# Altium project MiniRobot.PrjPcb
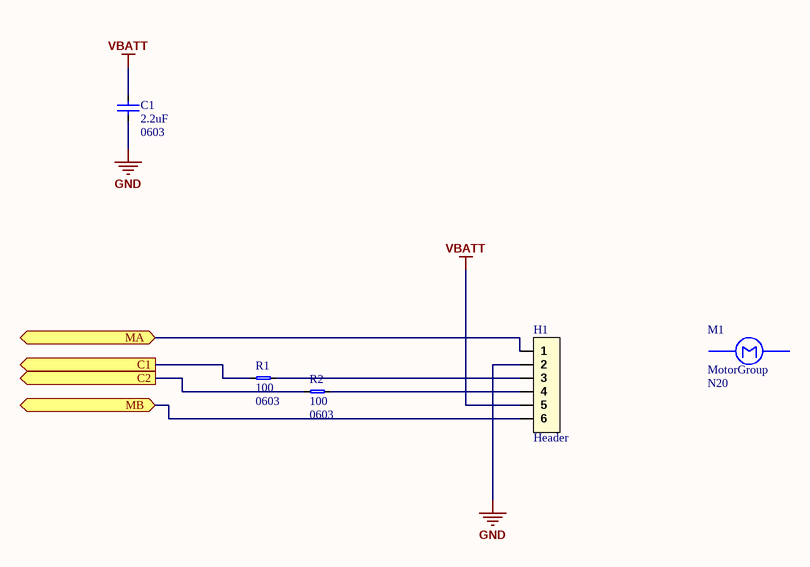
[diagram p0: MR_Motor.SchDoc]
6 sheets, 47 parts. Net scope: flat (ports and power ports of the same name join across sheets).
Board file: MiniRobot.PcbDoc
Sheets:
  MR_Motor.SchDoc
  MR_Motor_Control.SchDoc
  MR_Mcu.SchDoc
  MR_Power.SchDoc
  MR_RangeSensor.SchDoc
  MR_UartConnector.SchDoc

## Sheet MR_Motor.SchDoc
size A4; CompanyName: BeeIonic; SheetNumber: 2; SheetTotal: 7

### Parts
C1  value 2.2uF  Package: 0603  [0603_CAP_LD]  (hidden comment: CerCap)
H1  Header  [HEADER_1X6_PICOBLADE_653106124022]
M1  MotorGroup  Reference: N20  [MotorGroup]
R1  value 100  Package: 0603  [0603_RES_LD]  (hidden comment: Resistor)
R2  value 100  Package: 0603  [0603_RES_LD]  (hidden comment: Resistor)

### Ports
C1 (out), C2 (out), MA (bidir), MB (bidir)

### Nets
GND: C1.1 H1.2
VBATT: C1.2 H1.5
NetH1_1: H1.1 ; port MA
NetH1_3: H1.3 R1.2
NetH1_4: H1.4 R2.2
NetH1_6: H1.6 ; port MB
NetR1_1: R1.1 ; port C1
NetR2_1: R2.1 ; port C2

### Notes on the sheet
- Project :
- Title :
- Sheet:
- of
- Creation Date :
- Designer :
- Modified Date :

### Library data of the parts
C1 = CerCap: Ceramic Capacitor; Type: *; Voltage/Power: *
H1 = Header_6x1: Header 6x1 Pins
M1 = Motor
R1 R2 = Resistor: Precision: *

## Sheet MR_Motor_Control.SchDoc
size A4; CompanyName: BeeIonic; SheetNumber: 3; SheetTotal: 7
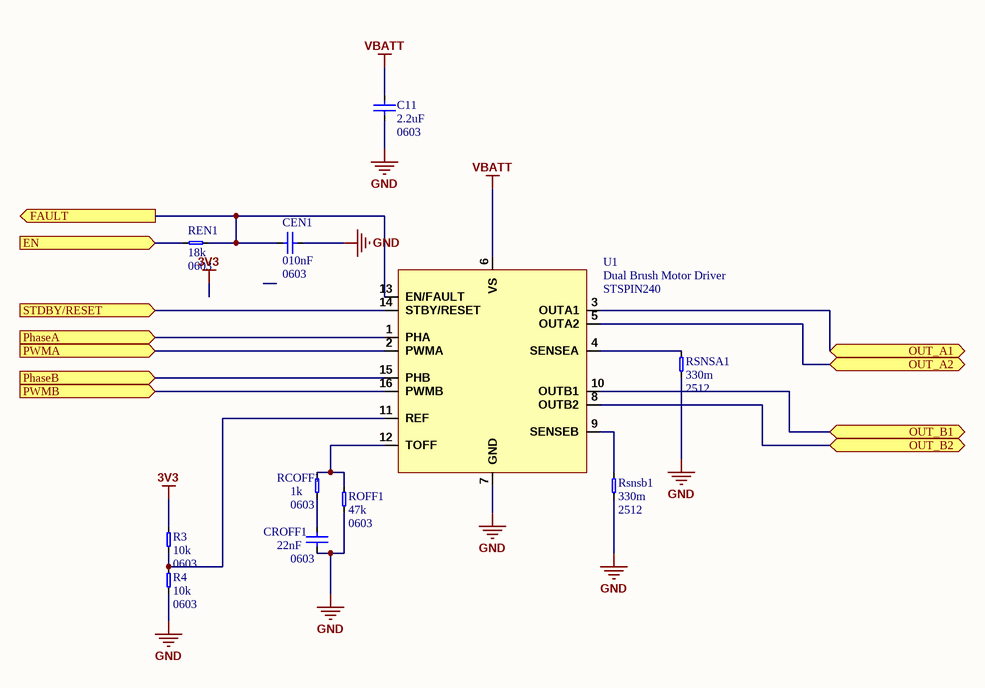
[diagram p1: MR_Motor_Control.SchDoc]

### Parts
C11  value 2.2uF  Package: 0603  [0603_CAP_LD]  (hidden comment: CerCap)
CEN1  value 010nF  Package: 0603  [0603_CAP_LD]  (hidden comment: CerCap)
CROFF1  value 22nF  Package: 0603  [0603_CAP_LD]  (hidden comment: CerCap)
R3  value 10k  Package: 0603  [0603_RES_LD]  (hidden comment: Resistor)
R4  value 10k  Package: 0603  [0603_RES_LD]  (hidden comment: Resistor)
RCOFF1  value 1k  Package: 0603  [0603_RES_LD]  (hidden comment: Resistor)
REN1  value 18k  Package: 0603  [0603_RES_LD]  (hidden comment: Resistor)
ROFF1  value 47k  Package: 0603  [0603_RES_LD]  (hidden comment: Resistor)
RSNSA1  value 330m  Package: 2512  [2512_RES_LD]  (hidden comment: Resistor)
Rsnsb1  value 330m  Package: 2512  [2512_RES_LD]  (hidden comment: Resistor)
U1  Dual Brush Motor Driver  [QFN-STSPIN240]

### Ports
EN (in), FAULT (out), OUT_A1 (bidir), OUT_A2 (bidir), OUT_B1 (bidir), OUT_B2 (bidir), PhaseA (in), PhaseB (in), PWMA (in), PWMB (in), STDBY/RESET (in)

### Nets
3V3: R3.2
GND: C11.1 CEN1.1 CROFF1.1 R4.1 ROFF1.1 RSNSA1.1 Rsnsb1.1 U1.7(GND)
VBATT: C11.2 U1.6(VS)
NetCEN1_2: CEN1.2 REN1.2 U1.13(EN/FAULT) ; port FAULT
NetCROFF1_2: CROFF1.2 RCOFF1.1
NetR3_1: R3.1 R4.2 U1.11(REF)
NetR11_1: U1.10(OUTB1) ; port OUT_B1
NetRCOFF1_2: RCOFF1.2 ROFF1.2 U1.12(TOFF)
NetREN1_1: REN1.1 ; port EN
NetRSNSA1_2: RSNSA1.2 U1.4(SENSEA)
NetRsnsb1_2: Rsnsb1.2 U1.9(SENSEB)
NetU1_1: U1.1(PHA) ; port PhaseA
NetU1_2: U1.2(PWMA) ; port PWMA
NetU1_3: U1.3(OUTA1) ; port OUT_A1
NetU1_5: U1.5(OUTA2) ; port OUT_A2
NetU1_8: U1.8(OUTB2) ; port OUT_B2
NetU1_14: U1.14(STBY/RESET) ; port STDBY/RESET
NetU1_15: U1.15(PHB) ; port PhaseB
NetU1_16: U1.16(PWMB) ; port PWMB

### Notes on the sheet
- Project :
- Title :
- Sheet:
- of
- Creation Date :
- Designer :
- Modified Date :

### Library data of the parts
C11 CEN1 CROFF1 = CerCap: Ceramic Capacitor; Type: *; Voltage/Power: *
U1 = STSPIN240: ST Dual Motor Driver; Reference: STSPIN240
R3 R4 RCOFF1 REN1 ROFF1 RSNSA1 Rsnsb1 = Resistor: Precision: *

## Sheet MR_Mcu.SchDoc
size A4; CompanyName: BeeIonic; SheetNumber: 4; SheetTotal: 7
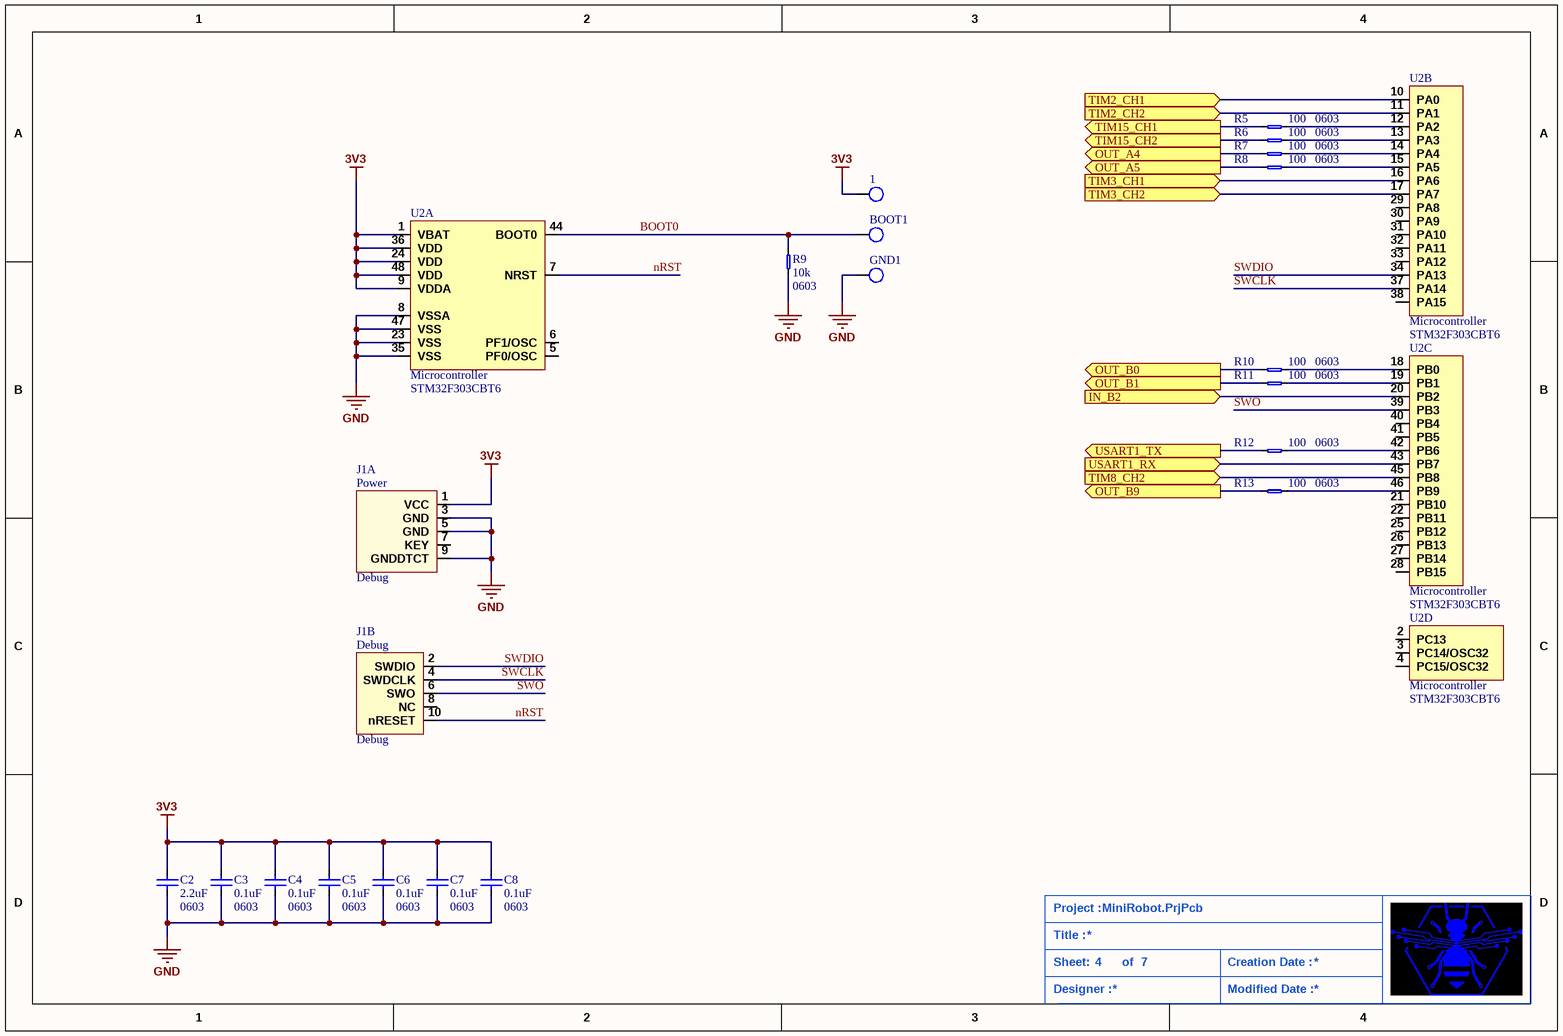
[diagram p2: MR_Mcu.SchDoc]

### Parts
1  TestPoint  [ROUND_TEST_POINT]  (value not drawn)  (no BOM)
BOOT1  TestPoint  [ROUND_TEST_POINT]  (value not drawn)  (no BOM)
C2  value 2.2uF  Package: 0603  [0603_CAP_LD]  (hidden comment: CerCap)
C3  value 0.1uF  Package: 0603  [0603_CAP_LD]  (hidden comment: CerCap)
C4  value 0.1uF  Package: 0603  [0603_CAP_LD]  (hidden comment: CerCap)
C5  value 0.1uF  Package: 0603  [0603_CAP_LD]  (hidden comment: CerCap)
C6  value 0.1uF  Package: 0603  [0603_CAP_LD]  (hidden comment: CerCap)
C7  value 0.1uF  Package: 0603  [0603_CAP_LD]  (hidden comment: CerCap)
C8  value 0.1uF  Package: 0603  [0603_CAP_LD]  (hidden comment: CerCap)
GND1  TestPoint  [ROUND_TEST_POINT]  (value not drawn)  (no BOM)
J1  Debug  [62201021121]  (parts A,B of 2)
R5  value 100  Package: 0603  [0603_RES_LD]  (hidden comment: Resistor)
R6  value 100  Package: 0603  [0603_RES_LD]  (hidden comment: Resistor)
R7  value 100  Package: 0603  [0603_RES_LD]  (hidden comment: Resistor)
R8  value 100  Package: 0603  [0603_RES_LD]  (hidden comment: Resistor)
R9  value 10k  Package: 0603  [0603_RES_LD]  (hidden comment: Resistor)
R10  value 100  Package: 0603  [0603_RES_LD]  (hidden comment: Resistor)
R11  value 100  Package: 0603  [0603_RES_LD]  (hidden comment: Resistor)
R12  value 100  Package: 0603  [0603_RES_LD]  (hidden comment: Resistor)
R13  value 100  Package: 0603  [0603_RES_LD]  (hidden comment: Resistor)
U2  Microcontroller  [STM32_LQFP48]  (parts A,B,C,D of 4)

### Ports
IN_B2 (in), OUT_A4 (out), OUT_A5 (out), OUT_B0 (out), OUT_B1 (out), OUT_B9 (out), TIM2_CH1 (in), TIM2_CH2 (in), TIM3_CH1 (in), TIM3_CH2 (in), TIM8_CH2 (in), TIM15_CH1 (out), TIM15_CH2 (out), USART1_RX (in), USART1_TX (out)

### Nets
3V3: 1.1(TP) C2.2 C3.2 C4.2 C5.2 C6.2 C7.2 C8.2 J1.1(VCC) U2.1(VBAT) U2.9(VDDA) U2.24(VDD) U2.36(VDD) U2.48(VDD)
GND: C2.1 C3.1 C4.1 C5.1 C6.1 C7.1 C8.1 GND1.1(TP) J1.3(GND) J1.5(GND) J1.9(GNDDTCT) R9.1 U2.8(VSSA) U2.23(VSS) U2.35(VSS) U2.47(VSS)
BOOT0: BOOT1.1(TP) R9.2 U2.44(BOOT0)
nRST: J1.10(nRESET) U2.7(NRST)
SWCLK: J1.4(SWDCLK) U2.37(PA14)
SWDIO: J1.2(SWDIO) U2.34(PA13)
SWO: J1.6(SWO) U2.39(PB3)
NetR5_1: R5.1 ; port TIM15_CH1
NetR5_2: R5.2 U2.12(PA2)
NetR6_1: R6.1 ; port TIM15_CH2
NetR6_2: R6.2 U2.13(PA3)
NetR7_1: R7.1 ; port OUT_A4
NetR7_2: R7.2 U2.14(PA4)
NetR8_1: R8.1 ; port OUT_A5
NetR8_2: R8.2 U2.15(PA5)
NetR10_1: R10.1 ; port OUT_B0
NetR10_2: R10.2 U2.18(PB0)
NetR11_1: R11.1 ; port OUT_B1
NetR11_2: R11.2 U2.19(PB1)
NetR12_1: R12.1 ; port USART1_TX
NetR12_2: R12.2 U2.42(PB6)
NetR13_1: R13.1 ; port OUT_B9
NetR13_2: R13.2 U2.46(PB9)
NetU2_10: U2.10(PA0) ; port TIM2_CH1
NetU2_11: U2.11(PA1) ; port TIM2_CH2
NetU2_16: U2.16(PA6) ; port TIM3_CH1
NetU2_17: U2.17(PA7) ; port TIM3_CH2
NetU2_20: U2.20(PB2) ; port IN_B2
NetU2_43: U2.43(PB7) ; port USART1_RX
NetU2_45: U2.45(PB8) ; port TIM8_CH2

Not connected (* = marked no-connect by the designer): J1 7(KEY) 8(NC); U2 2(PC13) 3(PC14/OSC32) 4(PC15/OSC32) 5(PF0/OSC) 6(PF1/OSC) 21(PB10) 22(PB11) 25(PB12) 26(PB13) 27(PB14) 28(PB15) 29(PA8) 30(PA9) 31(PA10) 32(PA11) 33(PA12) 38(PA15) 40(PB4) 41(PB5)

### Notes on the sheet
- Project :
- Title :
- Sheet:
- of
- Creation Date :
- Designer :
- Modified Date :
- (in symbol Cortex_10x2, part A) Power

### Library data of the parts
C2-C8 = CerCap: Ceramic Capacitor; Type: *; Voltage/Power: *
J1 = Cortex_10x2: Cortex 10 pins Debug Connector
U2 = STM32F303CBT6: STM32F303 Microcontroller; Reference: STM32F303CBT6
R5-R13 = Resistor: Precision: *

## Sheet MR_Power.SchDoc
size A4; CompanyName: BeeIonic; SheetNumber: 5; SheetTotal: 7
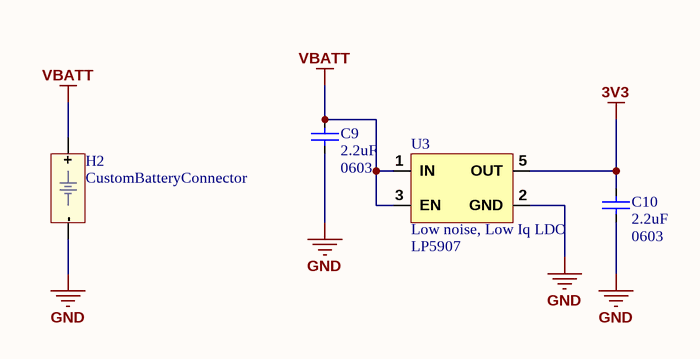
[diagram p3: MR_Power.SchDoc]

### Parts
C9  value 2.2uF  Package: 0603  [0603_CAP_LD]  (hidden comment: CerCap)
C10  value 2.2uF  Package: 0603  [0603_CAP_LD]  (hidden comment: CerCap)
H2  CustomBatteryConnector  [CustomBatteryConnector]
U3  Low noise, Low Iq LDO  [LP5907]

### Nets
3V3: C10.2 U3.5(OUT)
GND: C9.1 C10.1 H2.- U3.2(GND)
VBATT: C9.2 H2.+ U3.1(IN) U3.3(EN)

Not connected (* = marked no-connect by the designer): U3 4(NC)

### Notes on the sheet
- Project :
- Title :
- Sheet:
- of
- Creation Date :
- Designer :
- Modified Date :

### Library data of the parts
C9 C10 = CerCap: Ceramic Capacitor; Type: *; Voltage/Power: *
H2 = BatteryConnector: Custom Battery Connector
U3 = LP5907: LP5907 Low Noise Low Iq LDO; Reference: LP5907

## Sheet MR_RangeSensor.SchDoc
size A4; CompanyName: BeeIonic; SheetNumber: 6; SheetTotal: 7
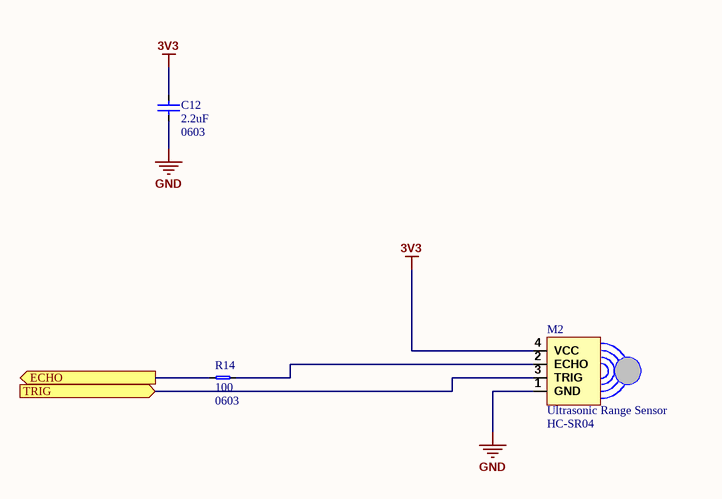
[diagram p4: MR_RangeSensor.SchDoc]

### Parts
C12  value 2.2uF  Package: 0603  [0603_CAP_LD]  (hidden comment: CerCap)
M2  Ultrasonic Range Sensor  [HC-SR04]
R14  value 100  Package: 0603  [0603_RES_LD]  (hidden comment: Resistor)

### Ports
ECHO (out), TRIG (in)

### Nets
3V3: C12.2 M2.4(VCC)
GND: C12.1 M2.1(GND)
NetM2_2: M2.2(ECHO) R14.2
NetM2_3: M2.3(TRIG) ; port TRIG
NetR14_1: R14.1 ; port ECHO

### Notes on the sheet
- Project :
- Title :
- Sheet:
- of
- Creation Date :
- Designer :
- Modified Date :

### Library data of the parts
C12 = CerCap: Ceramic Capacitor; Type: *; Voltage/Power: *
M2 = HC-SR04: Reference: HC-SR04
R14 = Resistor: Precision: *

## Sheet MR_UartConnector.SchDoc
size A4; CompanyName: BeeIonic; SheetNumber: 7; SheetTotal: 7
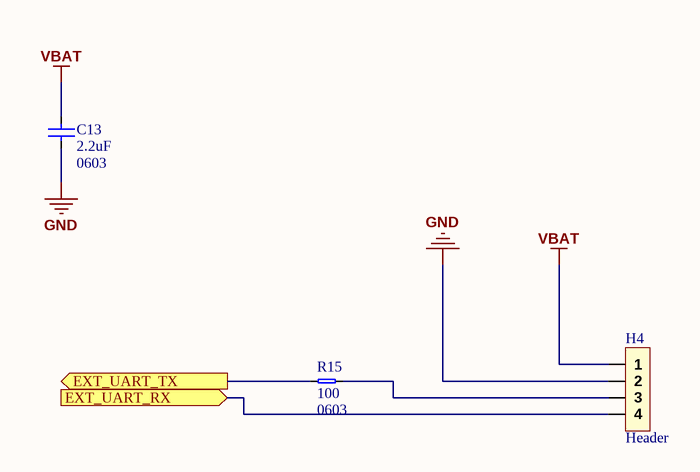
[diagram p5: MR_UartConnector.SchDoc]

### Parts
C13  value 2.2uF  Package: 0603  [0603_CAP_LD]  (hidden comment: CerCap)
H4  Header  [HE14 1x4 Straight]
R15  value 100  Package: 0603  [0603_RES_LD]  (hidden comment: Resistor)

### Ports
EXT_UART_RX (in), EXT_UART_TX (out)

### Nets
GND: C13.1 H4.2
VBAT: C13.2 H4.1
NetH4_3: H4.3 R15.2
NetH4_4: H4.4 ; port EXT_UART_RX
NetR15_1: R15.1 ; port EXT_UART_TX

### Notes on the sheet
- Project :
- Title :
- Sheet:
- of
- Creation Date :
- Designer :
- Modified Date :

### Library data of the parts
C13 = CerCap: Ceramic Capacitor; Type: *; Voltage/Power: *
H4 = Header_4x1: Header 4x1 PIns
R15 = Resistor: Precision: *

## Nets that join several sheets
3V3: MR_Motor_Control (R3.2), MR_Mcu (14 pins), MR_Power (C10.2 U3.5), MR_RangeSensor (C12.2 M2.4)
GND: MR_Motor (C1.1 H1.2), MR_Motor_Control (8 pins), MR_Mcu (16 pins), MR_Power (C9.1 C10.1 H2.- U3.2), MR_RangeSensor (C12.1 M2.1), MR_UartConnector (C13.1 H4.2)
VBATT: MR_Motor (C1.2 H1.5), MR_Motor_Control (C11.2 U1.6), MR_Power (C9.2 H2.+ U3.1 U3.3)
NetR11_1: MR_Motor_Control (U1.10), MR_Mcu (R11.1)